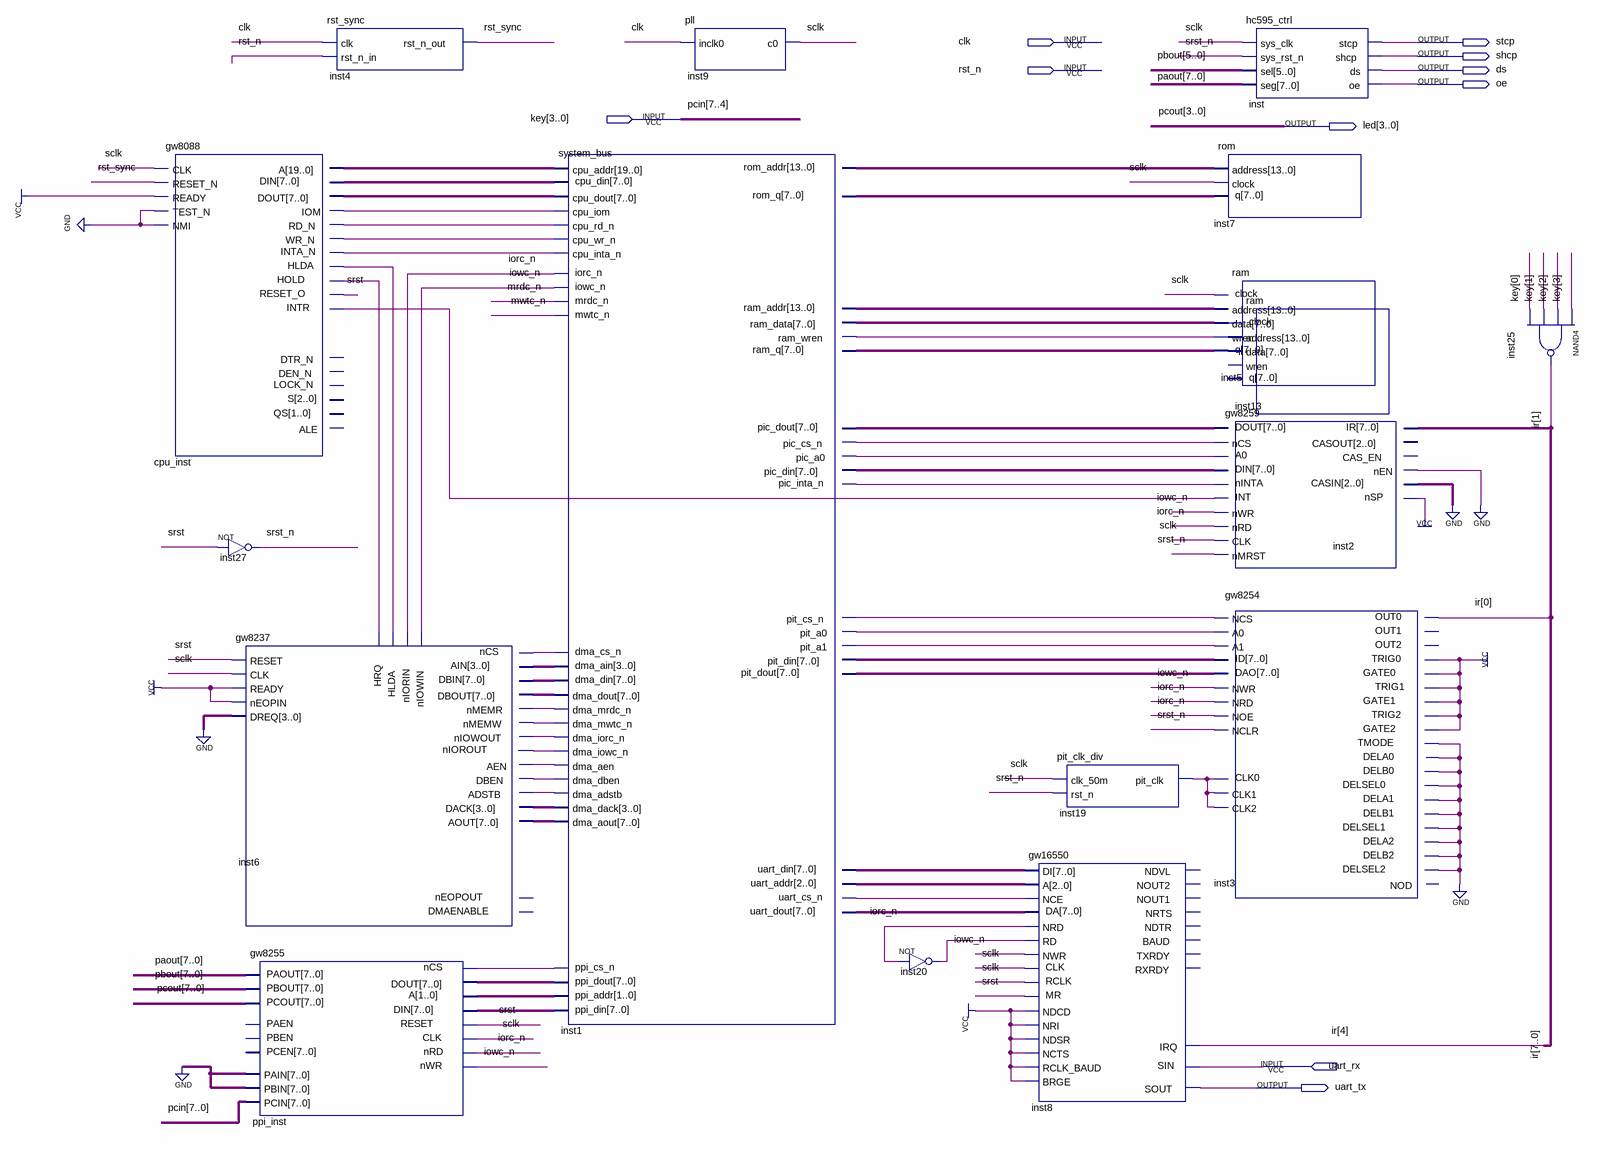
[diagram p0: schematic sheet]
// Quartus schematic top.bdf as structural Verilog: 17 symbols, 10 pins
module top (
  input  clk,
  input  rst_n,
  input  [3:0] key,
  input  uart_rx,
  output stcp,
  output shcp,
  output ds,
  output oe,
  output [3:0] led,
  output uart_tx
);

  wire cpu_inst_hlda, cpu_inst_inta_n, cpu_inst_iom, cpu_inst_rd_n, cpu_inst_wr_n, inst1_dma_cs_n,
       inst1_pic_a0, inst1_pic_cs_n, inst1_pic_inta_n, inst1_pit_a0, inst1_pit_a1, inst1_pit_cs_n,
       inst1_ppi_cs_n, inst1_ram_wren, inst1_uart_cs_n, inst2_int, inst2_nen, inst6_adstb, inst6_aen,
       inst6_dben, inst6_hrq, inst6_niorout, inst6_niowout, inst6_nmemr, inst6_nmemw, inst19_pit_clk,
       inst20_out, iorc_n, iowc_n, mrdc_n, mwtc_n, rst_sync, sclk, srst, srst_n;
  wire [1:0] inst1_ppi_addr;
  wire [2:0] inst1_uart_addr;
  wire [3:0] inst1_dma_ain, inst6_dack, pcin;
  wire [7:0] cpu_inst_dout, inst1_cpu_din, inst1_dma_din, inst1_pic_din, inst1_pit_din, inst1_ppi_din,
       inst1_ram_data, inst1_uart_din, inst2_dout, inst3_dao, inst5_q, inst6_aout, inst6_dbout, inst7_q,
       inst8_da, ir, paout, pbout, ppi_inst_dout;
  wire [7:4] pcout;
  wire [13:0] inst1_ram_addr, inst1_rom_addr;
  wire [19:0] cpu_inst_a;

  gw8088 cpu_inst (
    .CLK(sclk), .DIN(inst1_cpu_din), .RESET_N(rst_sync), .READY(1'b1), .TEST_N(1'b0), .NMI(1'b0),
    .INTR(inst2_int), .HOLD(inst6_hrq), .A(cpu_inst_a), .DOUT(cpu_inst_dout), .IOM(cpu_inst_iom),
    .RD_N(cpu_inst_rd_n), .WR_N(cpu_inst_wr_n), .INTA_N(cpu_inst_inta_n), .RESET_O(srst), .HLDA(cpu_inst_hlda));  // open: ALE, DTR_N, DEN_N, LOCK_N, S, QS
  not inst27 (srst_n, srst);
  gw8237 inst6 (
    .RESET(srst), .CLK(sclk), .nCS(inst1_dma_cs_n), .nIORIN(iorc_n), .nIOWIN(iowc_n), .READY(1'b1),
    .HLDA(cpu_inst_hlda), .nEOPIN(1'b1), .AIN(inst1_dma_ain), .DREQ(4'b0000), .DBIN(inst1_dma_din),
    .DBOUT(inst6_dbout), .DBEN(inst6_dben), .AOUT(inst6_aout), .HRQ(inst6_hrq), .DACK(inst6_dack),
    .AEN(inst6_aen), .ADSTB(inst6_adstb), .nIOROUT(inst6_niorout), .nIOWOUT(inst6_niowout),
    .nMEMR(inst6_nmemr), .nMEMW(inst6_nmemw));  // open: nEOPOUT, DMAENABLE
  gw8255 ppi_inst (
    .RESET(srst), .CLK(sclk), .nCS(inst1_ppi_cs_n), .nRD(iorc_n), .nWR(iowc_n), .A(inst1_ppi_addr),
    .DIN(inst1_ppi_din), .PAIN({8{1'b0}}), .PBIN({8{1'b0}}), .PCIN({key, pcin}), .DOUT(ppi_inst_dout),
    .PAOUT(paout), .PBOUT(pbout), .PCOUT({pcout, led}));  // open: PAEN, PBEN, PCEN
  rst_sync inst4 (.clk(clk), .rst_n_in(rst_n), .rst_n_out(rst_sync));
  system_bus inst1 (
    .cpu_rd_n(cpu_inst_rd_n), .cpu_wr_n(cpu_inst_wr_n), .cpu_iom(cpu_inst_iom), .cpu_addr(cpu_inst_a),
    .cpu_dout(cpu_inst_dout), .cpu_inta_n(cpu_inst_inta_n), .ram_q(inst5_q), .rom_q(inst7_q),
    .pic_dout(inst2_dout), .pit_dout(inst3_dao), .ppi_dout(ppi_inst_dout), .uart_dout(inst8_da),
    .dma_dout(inst6_dbout), .dma_mrdc_n(inst6_nmemr), .dma_mwtc_n(inst6_nmemw), .dma_iorc_n(inst6_niowout),
    .dma_iowc_n(inst6_niorout), .dma_aen(inst6_aen), .dma_dben(inst6_dben), .dma_adstb(inst6_adstb),
    .dma_dack(inst6_dack), .dma_aout(inst6_aout), .cpu_din(inst1_cpu_din), .iorc_n(iorc_n), .iowc_n(iowc_n),
    .mrdc_n(mrdc_n), .mwtc_n(mwtc_n), .ram_wren(inst1_ram_wren), .ram_addr(inst1_ram_addr),
    .ram_data(inst1_ram_data), .rom_addr(inst1_rom_addr), .pic_cs_n(inst1_pic_cs_n), .pic_a0(inst1_pic_a0),
    .pic_din(inst1_pic_din), .pic_inta_n(inst1_pic_inta_n), .pit_cs_n(inst1_pit_cs_n), .pit_a0(inst1_pit_a0),
    .pit_a1(inst1_pit_a1), .pit_din(inst1_pit_din), .ppi_cs_n(inst1_ppi_cs_n), .ppi_addr(inst1_ppi_addr),
    .ppi_din(inst1_ppi_din), .uart_din(inst1_uart_din), .uart_addr(inst1_uart_addr),
    .uart_cs_n(inst1_uart_cs_n), .dma_cs_n(inst1_dma_cs_n), .dma_ain(inst1_dma_ain), .dma_din(inst1_dma_din));
  pll inst9 (.inclk0(clk), .c0(sclk));
  not inst20 (inst20_out, iorc_n);
  pit_clk_div inst19 (.clk_50m(sclk), .rst_n(srst_n), .pit_clk(inst19_pit_clk));
  gw16550 inst8 (
    .CLK(sclk), .RCLK(sclk), .MR(srst), .A(inst1_uart_addr), .DI(inst1_uart_din), .NCE(inst1_uart_cs_n),
    .NRD(iorc_n), .RD(inst20_out), .NWR(iowc_n), .NDCD(1'b1), .NRI(1'b1), .NDSR(1'b1), .NCTS(1'b1),
    .SIN(uart_rx), .RCLK_BAUD(1'b1), .BRGE(1'b1), .DA(inst8_da), .IRQ(ir[4]), .SOUT(uart_tx));  // open: NDVL, NOUT2, NOUT1, NRTS, NDTR, BAUD, TXRDY, RXRDY
  hc595_ctrl inst (
    .sys_clk(sclk), .sys_rst_n(srst_n), .sel(pbout[5:0]), .seg(paout), .stcp(stcp), .shcp(shcp), .ds(ds),
    .oe(oe));
  rom inst7 (.address(inst1_rom_addr), .clock(sclk), .q(inst7_q));
  ram inst5 (.address(inst1_ram_addr), .clock(sclk), .data(inst1_ram_data), .wren(inst1_ram_wren), .q(inst5_q));
  ram inst13 ();  // open: address, clock, data, wren, q
  gw8259 inst2 (
    .nMRST(srst_n), .CLK(sclk), .nCS(inst1_pic_cs_n), .nWR(iowc_n), .nRD(iorc_n), .A0(inst1_pic_a0),
    .nINTA(inst1_pic_inta_n), .nSP(1'b1), .CASIN(3'b000), .IR(ir), .DIN(inst1_pic_din), .INT(inst2_int),
    .DOUT(inst2_dout), .nEN(inst2_nen));  // open: CASOUT, CAS_EN
  gw8254 inst3 (
    .ID(inst1_pit_din), .TMODE(1'b0), .CLK0(inst19_pit_clk), .DELA0(1'b0), .DELB0(1'b0), .DELSEL0(1'b0),
    .GATE0(1'b1), .TRIG0(1'b1), .CLK1(inst19_pit_clk), .DELA1(1'b0), .DELB1(1'b0), .DELSEL1(1'b0),
    .GATE1(1'b1), .TRIG1(1'b1), .CLK2(inst19_pit_clk), .DELA2(1'b0), .DELB2(1'b0), .DELSEL2(1'b0),
    .GATE2(1'b1), .TRIG2(1'b1), .NCLR(srst_n), .A0(inst1_pit_a0), .A1(inst1_pit_a1), .NCS(inst1_pit_cs_n),
    .NWR(iowc_n), .NRD(iorc_n), .NOE(iorc_n), .DAO(inst3_dao), .OUT0(ir[0]));  // open: NOD, OUT1, OUT2
  nand inst25 (ir[1], key[3], key[2], key[1], key[0]);
  // also tied to GND on the sheet: inst2_nen

  // Other names for the same wires on the sheet: pcin[7:4] = key; pcout[3:0] = led
endmodule
